# EAGLE design powerSupply (EAGLE 9.6.2)
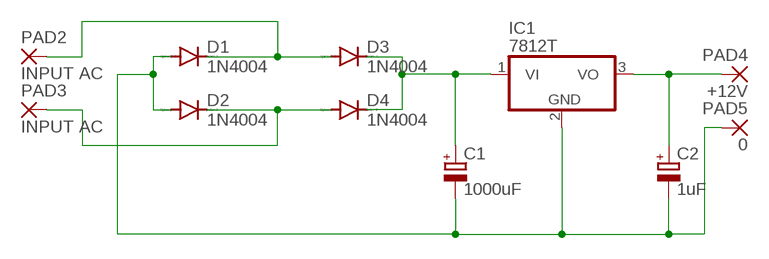
[diagram p0: schematic, sheet 1]

## Parts
C1  1000uF  CPOL-EUE3.5-10  [E3,5-10]
C2  1uF  CPOL-EUE2.5-5  [E2,5-5]
D1  1N4004  [DO41-10]
D2  1N4004  [DO41-10]
D3  1N4004  [DO41-10]
D4  1N4004  [DO41-10]
IC1  7812T  [TO220H]
PAD2  INPUT AC  2,54/1,0  [2,54/1,0]
PAD3  INPUT AC  2,54/1,0  [2,54/1,0]
PAD4  +12V  2,54/1,0  [2,54/1,0]
PAD5  0  2,54/1,0  [2,54/1,0]

## Nets
N$1: D1.C D3.A PAD2.1(P)
N$2: D2.C D4.A PAD3.1(P)
N$6: C1.+ D3.C D4.C IC1.1(VI)
N$7: C2.+ IC1.3(VO) PAD4.1(P)
N$8: C1.- C2.- D1.A D2.A IC1.2(GND) PAD5.1(P)

## Library data of the parts
C1 C2 = rcl:CPOL-EU: POLARIZED CAPACITOR, European symbol; SPICEPREFIX: C
D1-D4 = diode:1N4004: DIODE general purpose rectifier, 1 A
IC1 = linear:78*: Positive VOLTAGE REGULATOR Source: http://cache.national.com/ds/LM/LM78L05.pdf http://www.fairchildsemi.com/ds/LM/LM7805.pdf
PAD2-PAD5 = wirepad:2,54/1,0: THROUGH-HOLE PAD

## Board
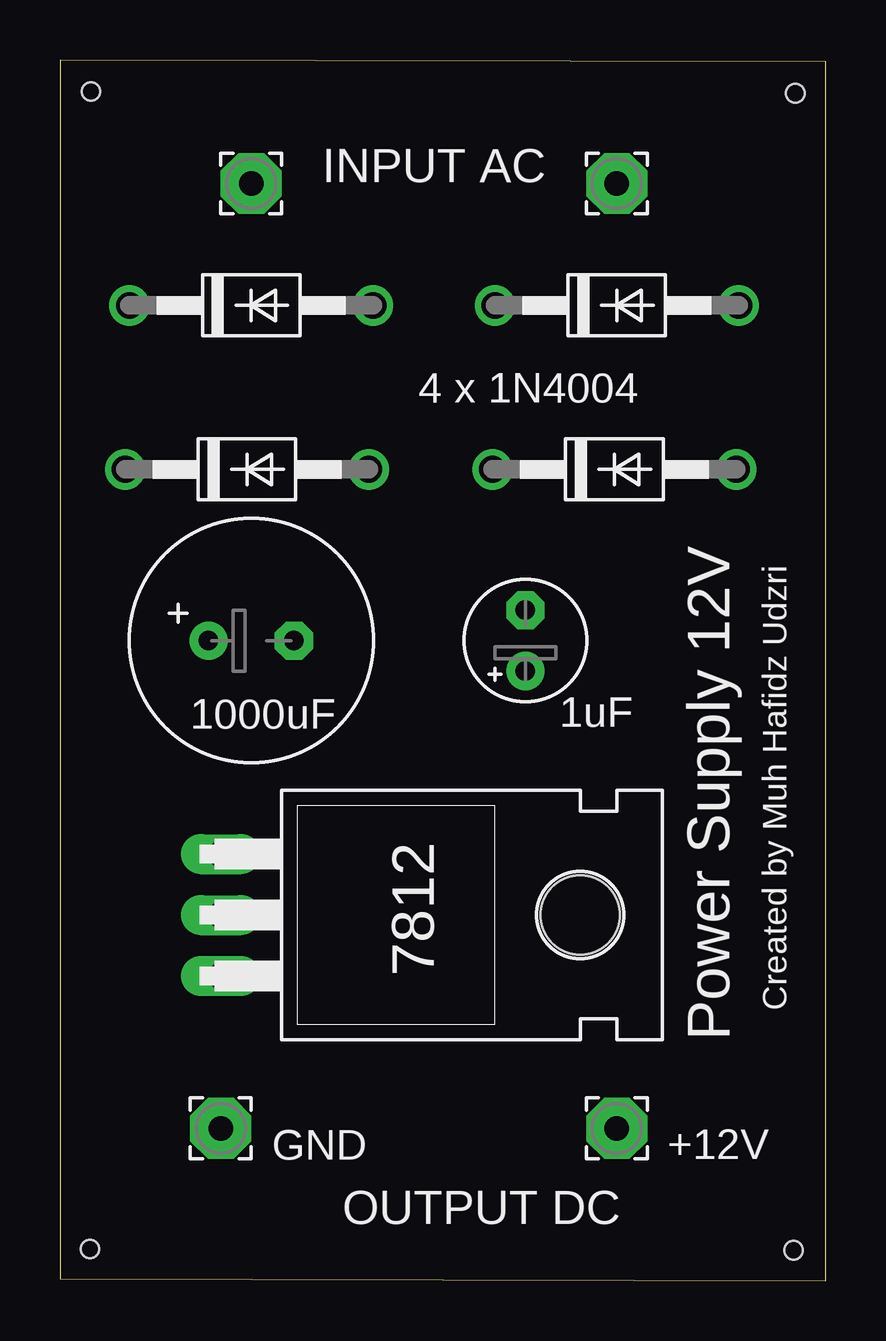
[diagram p1: board, top side]
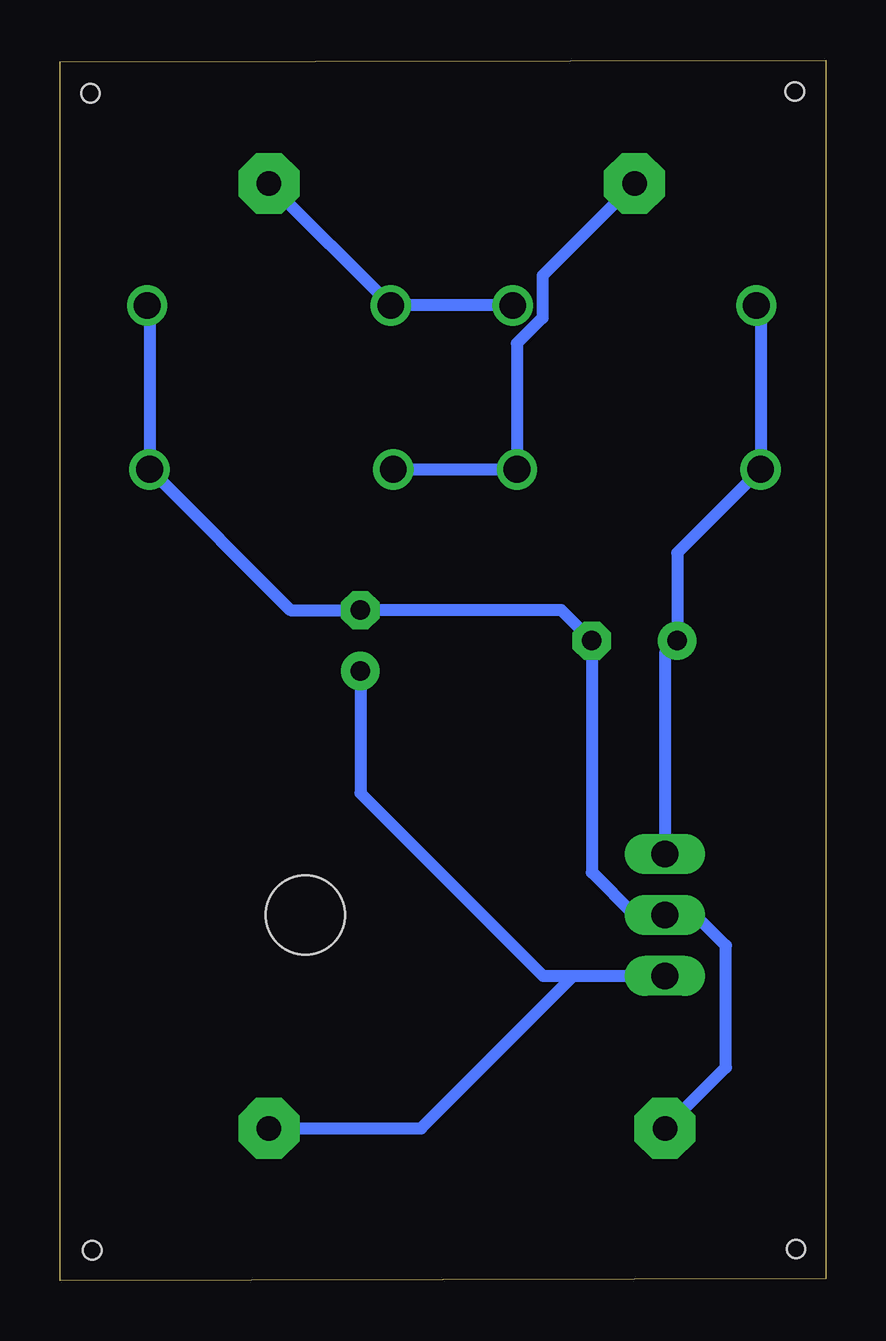
[diagram p2: board, bottom side, seen from below]

Size 31.93 x 50.87 mm. Coordinates in mm from the lower left corner, seen from the top.
Outline: 31.93,50.79 0,50.87 0,0.08 31.93,0 31.93,50.79
Copper layers (1*16): Top 0.035mm / dielectric 1.5mm / Bottom 0.035mm
Design rules "default": minimum track width 6mil, minimum drill 0.35mm, track to track 6mil, track to pad 6mil, pad to pad 6mil, via to via 6mil, smd to smd 6mil, copper to edge 40mil, drill to drill 6mil, minimum pad ring 10mil, minimum via ring 8mil, stop-mask expansion 4mil, vias tented up to drill 0mil, thermal gap 10mil
Holes 0.76 mm at 30.66,49.48 1.24,1.32 1.3,49.56 30.58,1.27

### Footprints (pad centres in the part's own frame; a part is rotated, then mirrored left to right if it is on the bottom)
E3,5-10 = drill 0.813 pad 1.6: + -1.778,0 | drill 0.813 pad 1.6 octagon: - 1.778,0
E2,5-5 = drill 0.813 pad 1.6: + -1.27,0 | drill 0.813 pad 1.6 octagon: - 1.27,0
DO41-10 = drill 1.118: A 5.08,0; C -5.08,0
TO220H = drill 1.118 long: 1 -2.54,-10.16; 2 0,-10.16; 3 2.54,-10.16 | hole 3.302: 0,4.826
2,54/1,0 = drill 1.016 pad 2.54 octagon: 1 0,0

### Placement (x,y rotation side)
C1  7.98,26.67 0 top
C2  19.41,26.67 90 top
D1  23.11,33.81 0 top
D2  23.22,40.64 0 top
D3  7.8,33.81 0 top
D4  7.98,40.64 0 top
IC1  16.87,15.24 270 top
PAD2  7.98,45.72 0 top
PAD3  23.22,45.72 0 top
PAD4  23.22,6.35 0 top
PAD5  6.71,6.35 0 top

### Tracks (layer width: path | path; a pad name or v marks a point on that pad's centre or on a via)
N$1
  Bottom 0.508: PAD2.1 11.81,41.88 11.81,40.12 12.88,39.06 D3.A D1.C
N$2
  Bottom 0.508: PAD3.1 D2.C D4.A
N$6
  Bottom 0.508: D4.C 2.72,40.46 D3.C 6.2,30.33 C1.+ 6.71,26.16 IC1.1
N$7
  Bottom 0.508: C2.+ 19.41,20.32 11.79,12.7 10.52,12.7 | 10.52,12.7 IC1.3 | PAD4.1 16.87,6.35 10.52,12.7
N$8
  Bottom 0.508: D2.A 28.19,40.54 D1.A 22.33,27.94 C2.- 11.02,27.94 C1.- 9.75,17.02 7.98,15.24 IC1.2 5.44,15.24 4.17,13.97 4.17,8.89 PAD5.1

### Text on the board
tPlace: INPUT AC | 4 x 1N4004 | 1000uF | 1uF | Power Supply 12V | 7812 | Created by Muh Hafidz Udzri | GND | +12V | OUTPUT DC